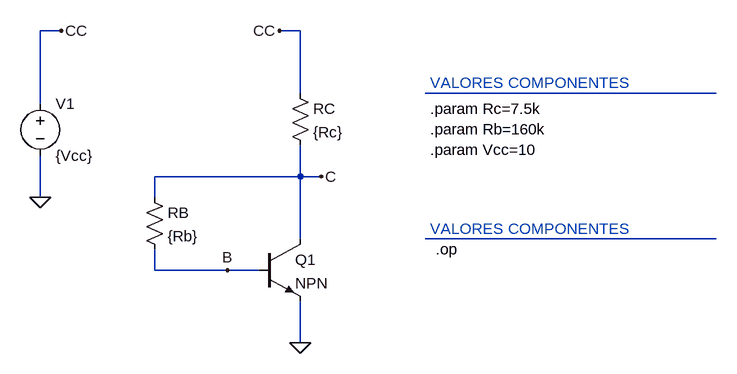
[diagram p0: schematic ejemplo3_P2.asc]
ejemplo3_P2.asc, the LTspice schematic file:
Version 4
SHEET 1 1064 680
WIRE -48 -192 -80 -192
WIRE 320 -192 288 -192
WIRE 320 -96 320 -192
WIRE 960 -96 512 -96
WIRE -80 -80 -80 -192
WIRE 320 32 320 -16
WIRE 320 32 96 32
WIRE 352 32 320 32
WIRE -80 64 -80 0
WIRE 96 64 96 32
WIRE 320 128 320 32
WIRE 960 128 512 128
WIRE 96 176 96 144
WIRE 208 176 96 176
WIRE 256 176 208 176
WIRE 320 288 320 224
FLAG -80 64 0
FLAG 208 176 B
FLAG 352 32 C
FLAG -48 -192 CC
FLAG 288 -192 CC
FLAG 320 288 0
SYMBOL voltage -80 -96 R0
WINDOW 123 0 0 Left 0
WINDOW 39 0 0 Left 0
SYMATTR InstName V1
SYMATTR Value {Vcc}
SYMBOL res 304 -112 R0
SYMATTR InstName RC
SYMATTR Value {Rc}
SYMBOL res 80 48 R0
SYMATTR InstName RB
SYMATTR Value {Rb}
SYMBOL npn 256 128 R0
SYMATTR InstName Q1
TEXT 520 -112 Left 2 ;VALORES COMPONENTES
TEXT 520 -72 Left 2 !.param Rc=7.5k \n.param Rb=160k \n.param Vcc=10
TEXT 520 112 Left 2 ;VALORES COMPONENTES
TEXT 528 144 Left 2 !.op

The netlist it stands for:
* ejemplo3_P2.asc
V1 CC 0 {Vcc}
RC CC C {Rc}
RB C B {Rb}
Q1 C B 0 0 NPN
.model NPN NPN
.model PNP PNP
.lib standard.bjt
* VALORES COMPONENTES
.param Rc=7.5k
.param Rb=160k
.param Vcc=10
* VALORES COMPONENTES
.op
.backanno
.end